# Altium schematic sheet SMR_Schematic.SchDoc
size B
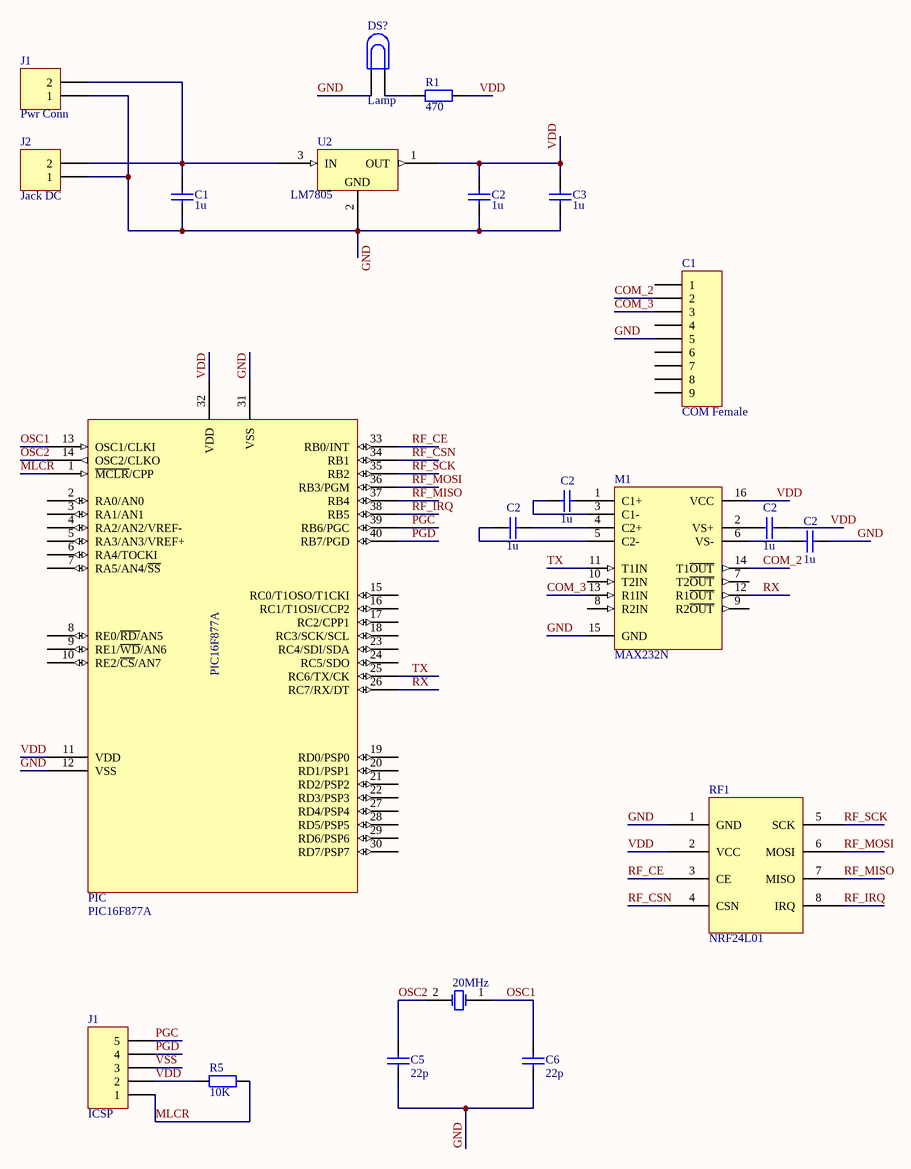
[diagram p0: SMR_Schematic.SchDoc]

## Parts
(Parts that share a designator on the sheet are numbered #1, #2 ... from top to bottom, then left to right.)
20MHz  XTAL  [BCY-W2/D3.1]  (value not drawn)
C1#1  value 1u  [RAD-0.3]
C1#2  COM Female  [HDR1X9]
C2#1  value 1u  [RAD-0.3]
C2#2  value 1u  [RAD-0.3]
C2#3  value 1u  [RAD-0.3]
C2#4  value 1u  [RAD-0.3]
C2#5  value 1u  [RAD-0.3]
C3  value 1u  [RAD-0.3]
C5  value 22p  [RAD-0.3]  (hidden comment: Cap)
C6  value 22p  [RAD-0.3]  (hidden comment: Cap)
DS?  Lamp  [PIN2]
J1#1  Pwr Conn  [HDR1X2H]
J1#2  ICSP  [HDR1X5]
J2  Jack DC  [HDR1X2]
M1  MAX232N  [DIP-16/X1.5]
PIC  PIC16F877A  [PIC16F877A]
R1  value 470  [AXIAL-0.4]  (hidden comment: Res1)
R5  value 10K  [AXIAL-0.4]  (hidden comment: Res2)
RF1  NRF24L01  [NRF24L01]
U2  LM7805  [LM7805]

## Nets
COM_2: C1#2.2 M1.14(T1~{OUT})
COM_3: C1#2.3 M1.13(R1IN)
GND: C1#1.1 C1#2.5 C2#1.1 C2#5.1 C3.1 C5.1 C6.1 DS?.1 J1#1.1 J2.1 M1.15(GND) PIC.12(VSS) PIC.31(VSS) RF1.1(GND) U2.2(GND)
MLCR: J1#2.1 PIC.1(~{MCLR}/CPP) R5.2
OSC1: 20MHz.1(OSC1) C6.2 PIC.13(OSC1/CLKI)
OSC2: 20MHz.2(OSC2) C5.2 PIC.14(OSC2/CLKO)
PGC: J1#2.5 PIC.39(RB6/PGC)
PGD: J1#2.4 PIC.40(RB7/PGD)
RF_CE: PIC.33(RB0/INT) RF1.3(CE)
RF_CSN: PIC.34(RB1) RF1.4(CSN)
RF_IRQ: PIC.38(RB5) RF1.8(IRQ)
RF_MISO: PIC.37(RB4) RF1.7(MISO)
RF_MOSI: PIC.36(RB3/PGM) RF1.6(MOSI)
RF_SCK: PIC.35(RB2) RF1.5(SCK)
RX: M1.12(R1~{OUT}) PIC.26(RC7/RX/DT)
TX: M1.11(T1IN) PIC.25(RC6/TX/CK)
VDD: C2#1.2 C2#4.1 C3.2 J1#2.2 M1.16(VCC) PIC.11(VDD) PIC.32(VDD) R1.2 R5.1 RF1.2(VCC) U2.1(OUT)
VSS: J1#2.3
NetC1#1_2: C1#1.2 J1#1.2 J2.2 U2.3(IN)
NetC2#2_1: C2#2.1 M1.1(C1+)
NetC2#2_2: C2#2.2 M1.3(C1-)
NetC2#3_1: C2#3.1 M1.4(C2+)
NetC2#3_2: C2#3.2 M1.5(C2-)
NetC2#4_2: C2#4.2 M1.2(VS+)
NetC2#5_2: C2#5.2 M1.6(VS-)
NetDS?_2: DS?.2 R1.1

Not connected (* = marked no-connect by the designer): C1#2 1 4 6 7 8 9; M1 7(T2~{OUT}) 8(R2IN) 9(R2~{OUT}) 10(T2IN); PIC 2(RA0/AN0) 3(RA1/AN1) 4(RA2/AN2/VREF-) 5(RA3/AN3/VREF+) 6(RA4/TOCKI) 7(RA5/AN4/~{SS}) 8(RE0/~{RD/}AN5) 9(RE1/~{WD}/AN6) 10(RE2/~{CS}/AN7) 15(RC0/T1OSO/T1CKI) 16(RC1/T1OSI/CCP2) 17(RC2/CPP1) 18(RC3/SCK/SCL) 19(RD0/PSP0) 20(RD1/PSP1) 21(RD2/PSP2) 22(RD3/PSP3) 23(RC4/SDI/SDA) 24(RC5/SDO) 27(RD4/PSP4) 28(RD5/PSP5) 29(RD6/PSP6) 30(RD7/PSP7)

## Library data of the parts
20MHz = XTAL: Crystal Oscillator; Manufacturer: Generic Components; Published: 08/06/2000; Publisher: Altium Hobart Technology Centre; Class: Oscillator; SubClass: Crystal Oscillator
C1#1 C2#1-C2#5 C3 C5 C6 = Cap: Capacitor; Manufacturer: Generic Components; Class: Passive; Published: 08/06/2000; Publisher: Altium Hobart Technology Centre; SubClass: Capacitor
C1#2 = Header 9: Header, 9-Pin; Manufacturer: Generic Components; Class: Connector
DS? = Lamp: Incandescent Bulb; Manufacturer: Generic Components; Published: 1999
J1#1 = Header 2H: Header, 2-Pin,  Right Angle; Manufacturer: Generic Components; Class: Connector
J1#2 = Header 5: Header, 5-Pin; Manufacturer: Generic Components; Class: Connector
J2 = Header 2: Header, 2-Pin; Manufacturer: Generic Components; Class: Connector
M1 = MAX232N: Dual EIA-232 Driver/Receiver; Manufacturer: Texas Instruments; Class: Interface; SubClass: Line Transceiver; Note: Receivers have typical hysteresis of 0.5V; Published: 15/05/2002; Publisher: Altium Hobart Technology Centre
R1 R5 = Res2: Resistor; Manufacturer: Generic Components; Class: Passive; Published: 08/06/2000; Publisher: Altium Hobart Technology Centre; SubClass: Resistor